# Altium schematic sheet IDCI_WifiNode_per.SchDoc
size A4
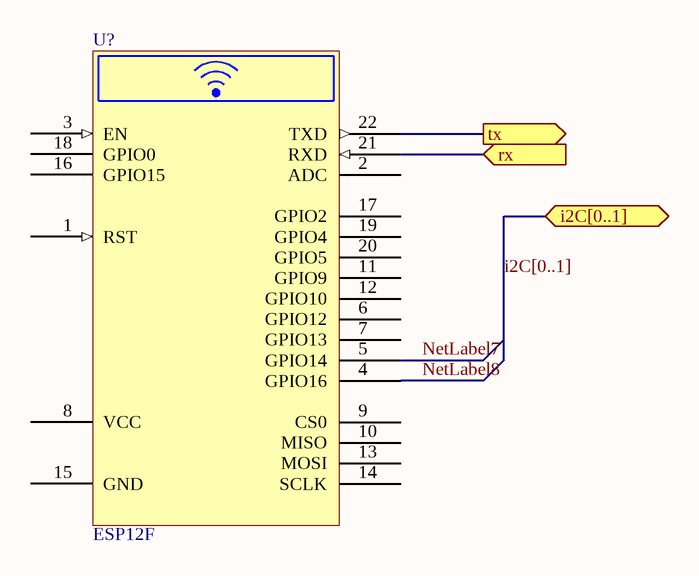
[diagram p0: IDCI_WifiNode_per.SchDoc]

## Parts
U?  ESP12F

## Ports
i2C[0..1] (bidir), rx (in), tx (out)

## Nets
NetLabel7: U?.5(GPIO14)
NetLabel8: U?.4(GPIO16)
rx: U?.21(RXD) ; port rx
tx: U?.22(TXD) ; port tx

Not connected (* = marked no-connect by the designer): U? 1(RST) 2(ADC) 3(EN) 6(GPIO12) 7(GPIO13) 8(VCC) 9(CS0) 10(MISO) 11(GPIO9) 12(GPIO10) 13(MOSI) 14(SCLK) 15(GND) 16(GPIO15) 17(GPIO2) 18(GPIO0) 19(GPIO4) 20(GPIO5)

## Buses and harness runs
bus i2C[0..1] = port i2C[0..1]

## Notes on the sheet
- Title:
- Size:
- Author:
- A4
- Sheet
- of
- Revision:
- File:
- Date:

## Library data of the parts
U? = ESP12F Wifi Module: Wifi Module